# EAGLE schematic NashDuino (EAGLE 6.4)
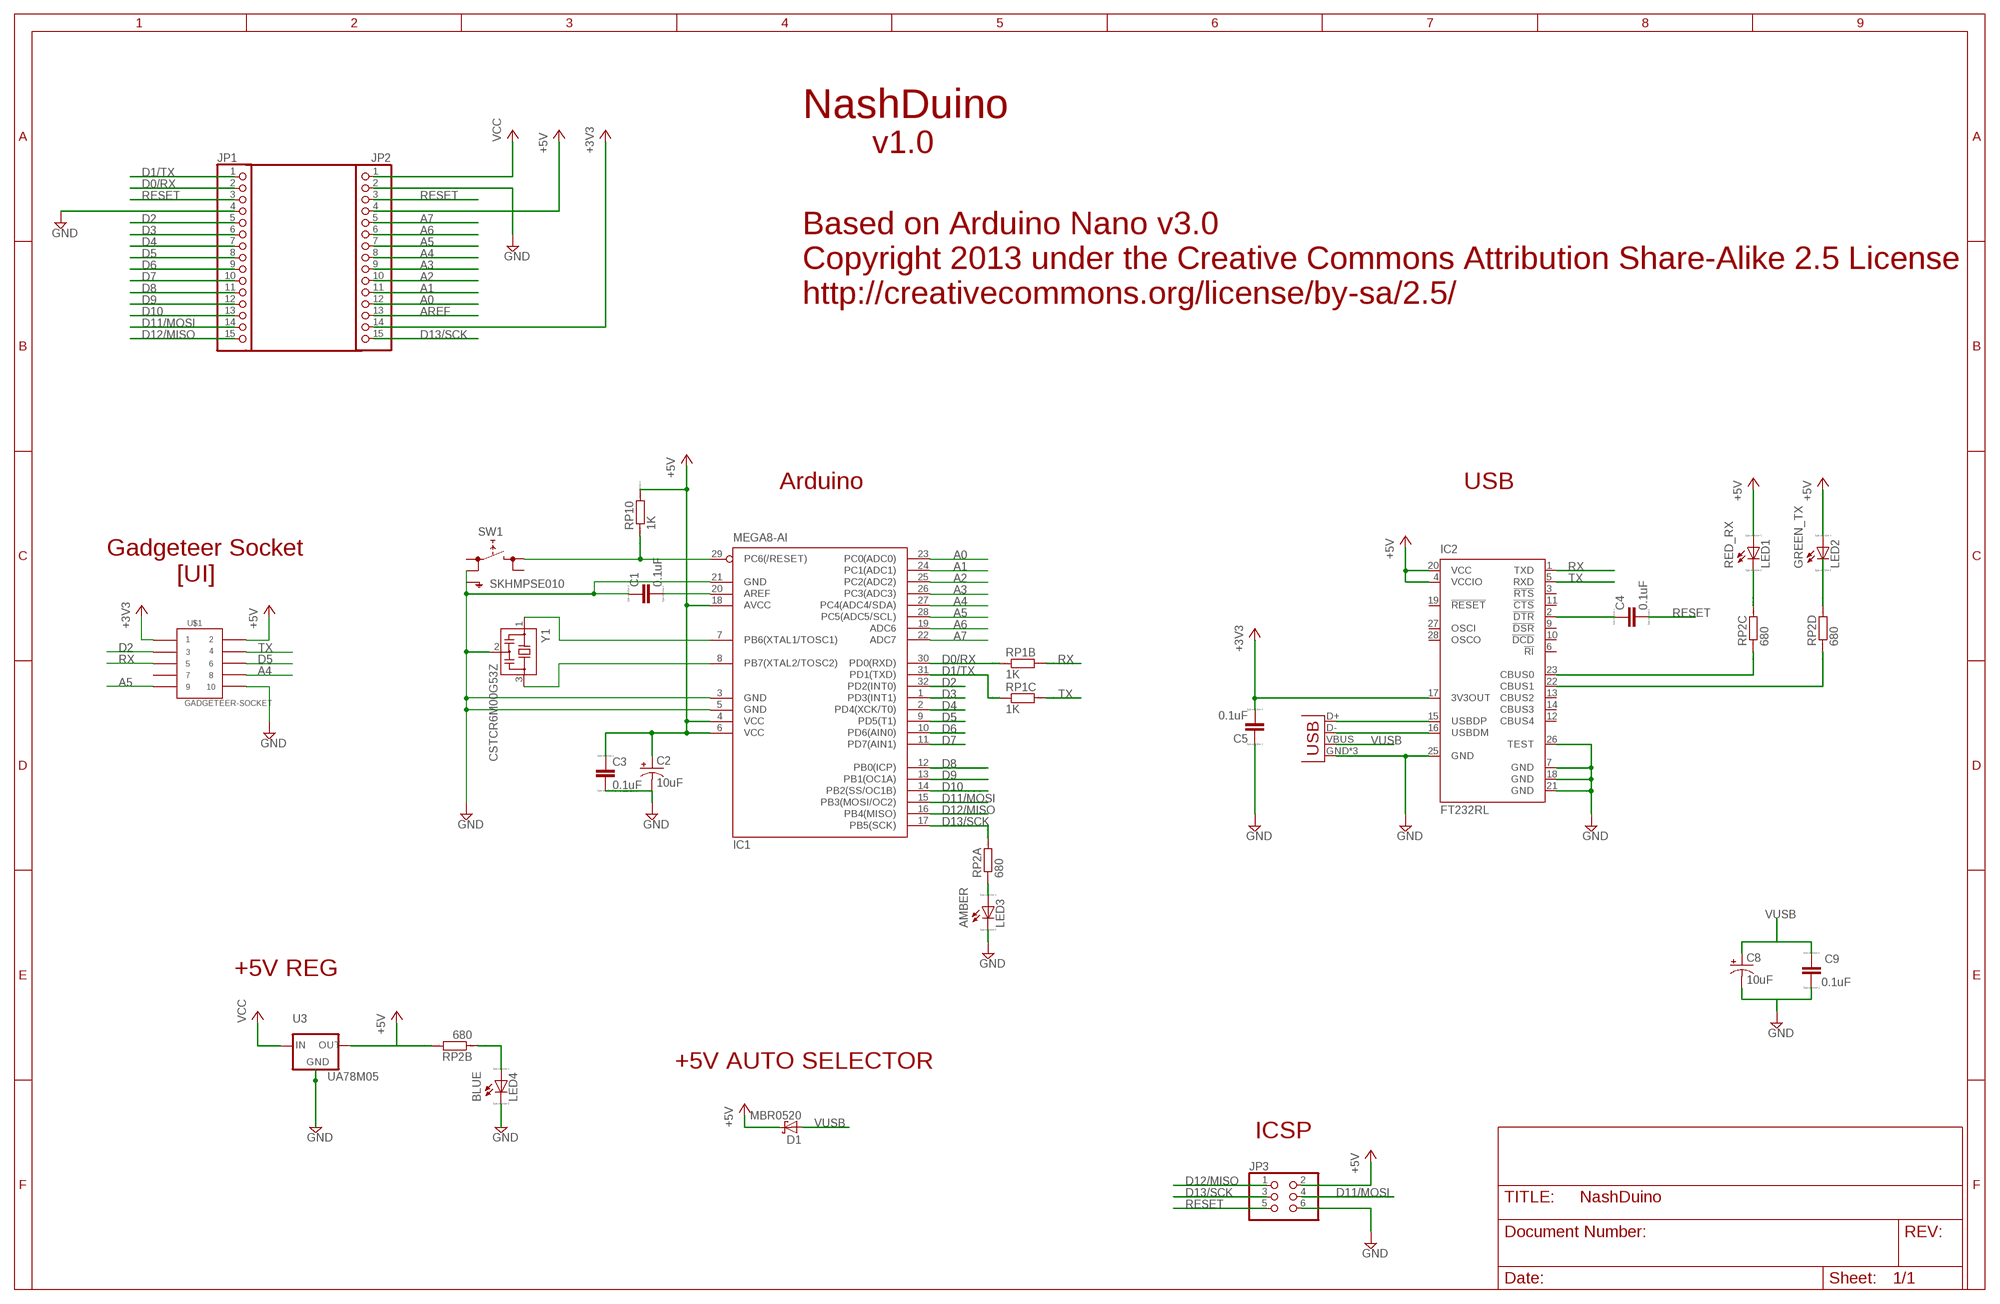
[diagram p0: schematic, sheet 1]

## Parts
C1  0.1uF  CC1206  [C1206]
C2  10uF  CAP_POL1206  [EIA3216]
C3  0.1uF  C  [C0805]
C4  0.1uF  CC1206  [C1206]
C5  0.1uF  CC1206  [C1206]
C8  10uF  CAP_POL1206  [EIA3216]
C9  0.1uF  CC1206  [C1206]
D1  MBR0520  SCHOTTKY-DIODESMD  [SMB]
IC1  MEGA8-AI  [TQFP32-08]
IC2  FT232RL  [SSOP28]
JP1  PINHD-1X15  [1X15]
JP2  PINHD-1X15  [1X15]
JP3  PINHD-2X3  [2X03]
JP4  USB-MICROB  [USB-MICROB]
LED1  RED_RX  LED_ESML0603  [LED_SML0603]
LED2  GREEN_TX  LED_ESML0603  [LED_SML0603]
LED3  AMBER  LED_ESML0603  [LED_SML0603]
LED4  BLUE  LED_ESML0603  [LED_SML0603]
RP1B  1K  RR0603  [R0603]
RP1C  1K  RR0603  [R0603]
RP2A  680  RR0603  [R0603]
RP2B  680  RR0603  [R0603]
RP2C  680  RR0603  [R0603]
RP2D  680  RR0603  [R0603]
RP10  1K  RR0603  [R0603]
SW1  SKHMPSE010  [SKHMPXE010]
U3  V_REG_MIC2920  [SOT223]
U$1  GADGETEER-SOCKET  [2X5_1.27MM]
Y1  CSTCR6M00G53Z  [CSTCR6M]

## Nets
+3V3: C5.2 IC2.17(3V3OUT) JP2.14 U$1.1
+5V: C2.A(+) C3.1 D1.C IC1.4(VCC) IC1.6(VCC) IC1.18(AVCC) IC2.4(VCCIO) IC2.20(VCC) JP2.4 JP3.2 LED1.A LED2.A RP2B.2 RP10.2 U3.3(OUT) U$1.2
A0: IC1.23(PC0(ADC0)) JP2.12
A1: IC1.24(PC1(ADC1)) JP2.11
A2: IC1.25(PC2(ADC2)) JP2.10
A3: IC1.26(PC3(ADC3)) JP2.9
A4: IC1.27(PC4(ADC4/SDA)) JP2.8 U$1.8
A5: IC1.28(PC5(ADC5/SCL)) JP2.7 U$1.9
A6: IC1.19(ADC6) JP2.6
A7: IC1.22(ADC7) JP2.5
AREF: JP2.13
D0/RX: IC1.30(PD0(RXD)) JP1.2 RP1B.1
D1/TX: IC1.31(PD1(TXD)) JP1.1 RP1C.1
D2: IC1.32(PD2(INT0)) JP1.5 U$1.3
D3: IC1.1(PD3(INT1)) JP1.6
D4: IC1.2(PD4(XCK/T0)) JP1.7
D5: IC1.9(PD5(T1)) JP1.8 U$1.6
D6: IC1.10(PD6(AIN0)) JP1.9
D7: IC1.11(PD7(AIN1)) JP1.10
D8: IC1.12(PB0(ICP)) JP1.11
D9: IC1.13(PB1(OC1A)) JP1.12
D10: IC1.14(PB2(SS/OC1B)) JP1.13
D11/MOSI: IC1.15(PB3(MOSI/OC2)) JP1.14 JP3.4
D12/MISO: IC1.16(PB4(MISO)) JP1.15 JP3.1
D13/SCK: IC1.17(PB5(SCK)) JP2.15 JP3.3 RP2A.2
GND: C1.1 C2.C(-) C3.2 C5.1 C8.C(-) C9.1 IC1.3(GND) IC1.5(GND) IC1.21(GND) IC2.7(GND) IC2.18(GND) IC2.21(GND) IC2.25(GND) IC2.26(TEST) JP1.4 JP2.2 JP3.6 JP4.GND JP4.MT1(GND) JP4.MT2(GND) LED3.C SW1.2(1.2) SW1.5(SH) U$1.10 Y1.2
N$1: IC1.8(PB7(XTAL2/TOSC2)) Y1.3
N$2: IC1.7(PB6(XTAL1/TOSC1)) Y1.1
N$3: LED4.A RP2B.1
N$4: LED4.C
N$5: C1.2 IC1.20(AREF)
N$6: IC1.29(PC6(/RESET)) RP10.1 SW1.3(2.1)
N$7: C4.1 IC2.2(!DTR)
N$8: IC2.15(USBDP) JP4.D+
N$9: U3.2(GND)
N$10: IC2.23(CBUS0) RP2C.1
N$11: LED1.C RP2C.2
N$12: IC2.22(CBUS1) RP2D.1
N$13: RP2D.2
N$14: IC2.16(USBDM) JP4.D-
N$21: LED3.A RP2A.1
RESET: C4.2 JP1.3 JP2.3 JP3.5
RX: IC2.1(TXD) RP1B.2 U$1.5
TX: IC2.5(RXD) RP1C.2 U$1.4
VCC: JP2.1 U3.1(IN)
VUSB: C8.A(+) C9.2 D1.A JP4.VBUS
Unconnected: IC2.3(!RTS) IC2.6(!RI) IC2.9(!DSR) IC2.10(!DCD) IC2.11(!CTS) IC2.12(CBUS4) IC2.13(CBUS2) IC2.14(CBUS3) IC2.19(!RESET) IC2.27(OSCI) IC2.28(OSCO) LED2.C SW1.1(1.1) SW1.4(2.2) U$1.7

## Notes on the sheet
- NashDuino
- v1.0
- Based on Arduino Nano v3.0
- Copyright 2013 under the Creative Commons Attribution Share-Alike 2.5 License
- http://creativecommons.org/license/by-sa/2.5/
- Arduino | USB
- Gadgeteer Socket 
            [UI]
- +5V REG
- +5V AUTO SELECTOR
- UA78M05
- ICSP

## Library data of the parts
C1 C3-C5 C9 = eagle-ltspice:C: CAPACITOR, European symbol; SPICEMODEL: NONE; SPICEPREFIX: C
C2 C8 = SparkFun-Capacitors:CAP_POL: Capacitor Polarized These are standard SMD and PTH capacitors. Normally 10uF, 47uF, and 100uF in electrolytic and tantalum varieties. Always verify the external diameter of the through hole cap, it varies with capacity, voltage, and manufacturer. The EIA devices should be standard.
D1 = diode:SCHOTTKY-DIODE: Schottky Diode
IC1 = atmel:MEGA8: MICROCONTROLLER 8 Kbytes FLASH, 1 kbytes SRAM, 512 bytes EEPROM, USART, 6-channel 10 bit ADC, 2-channel 8 bit ADC Pin compatible with Atmega48, ATMega88, ATMega168 Source: avr.lbr; MPN: ATMEGA8-16AU; OC_FARNELL: 9171371; OC_NEWARK: 73M8863
IC2 = ftdichip:FT232R: Source: http://www.ftdichip.com/Documents/DataSheets/DS_FT232R_v104.pdf; MPN: FT232RL; OC_FARNELL: 1146032; OC_NEWARK: 91K9918
JP1 JP2 = pinhead:PINHD-1X15: PIN HEADER
JP3 = pinhead:PINHD-2X3: PIN HEADER
JP4 = SparkFun-Connectors:USB: USB Connectors USB-B-PTH is fully proven SKU : PRT-00139/CONN-08278 USB-miniB is fully proven SKU : PRT-00587 USB-A-PCB is untested. USB-A-H is throughly reviewed, but untested. Spark Fun Electronics SKU : PRT-00437 USB-B-SMT is throughly reviewed, but untested. Needs silkscreen touching up. USB-A-S has not been used/tested USB-MB-H has not been used/tested USB-MICROB has been used. CONN-09505; PROD_ID: CONN-09505
LED1-LED4 = eagle-ltspice:LED_E: LED Source: http://www.osram.convergy.de Source: www.luxeon.com Source: www.kingbright.com; SPICEMODEL: NONE; SPICEPREFIX: D; SPICETYPE: diode
RP1B RP1C RP2A RP2B RP2C RP2D RP10 = eagle-ltspice:R: RESISTOR, European symbol; SPICEMODEL: NONE; SPICEPREFIX: R
SW1 = switch:SKHMP*E010: 6.2 X 6.5mm TACT Switch (SMD) Source: http://www3.alps.co.jp/WebObjects/catalog.woa/PDF/E/Switch/Tact/SKHM/SKHM.PDF
U3 = SparkFun-PowerIC:V_REG_MIC2920: MIC2920A (http://www.micrel.com/_PDF/mic2920.pdf) - 400mA output LDO Regulator
U$1 = SoftDust:GADGETEER-SOCKET
Y1 = murata-filter:CSTCR: Resonator Source: murata.co.jp; MPN: CSTCR6M00G53-R0; OC_FARNELL: 1170434; OC_NEWARK: 25M8759